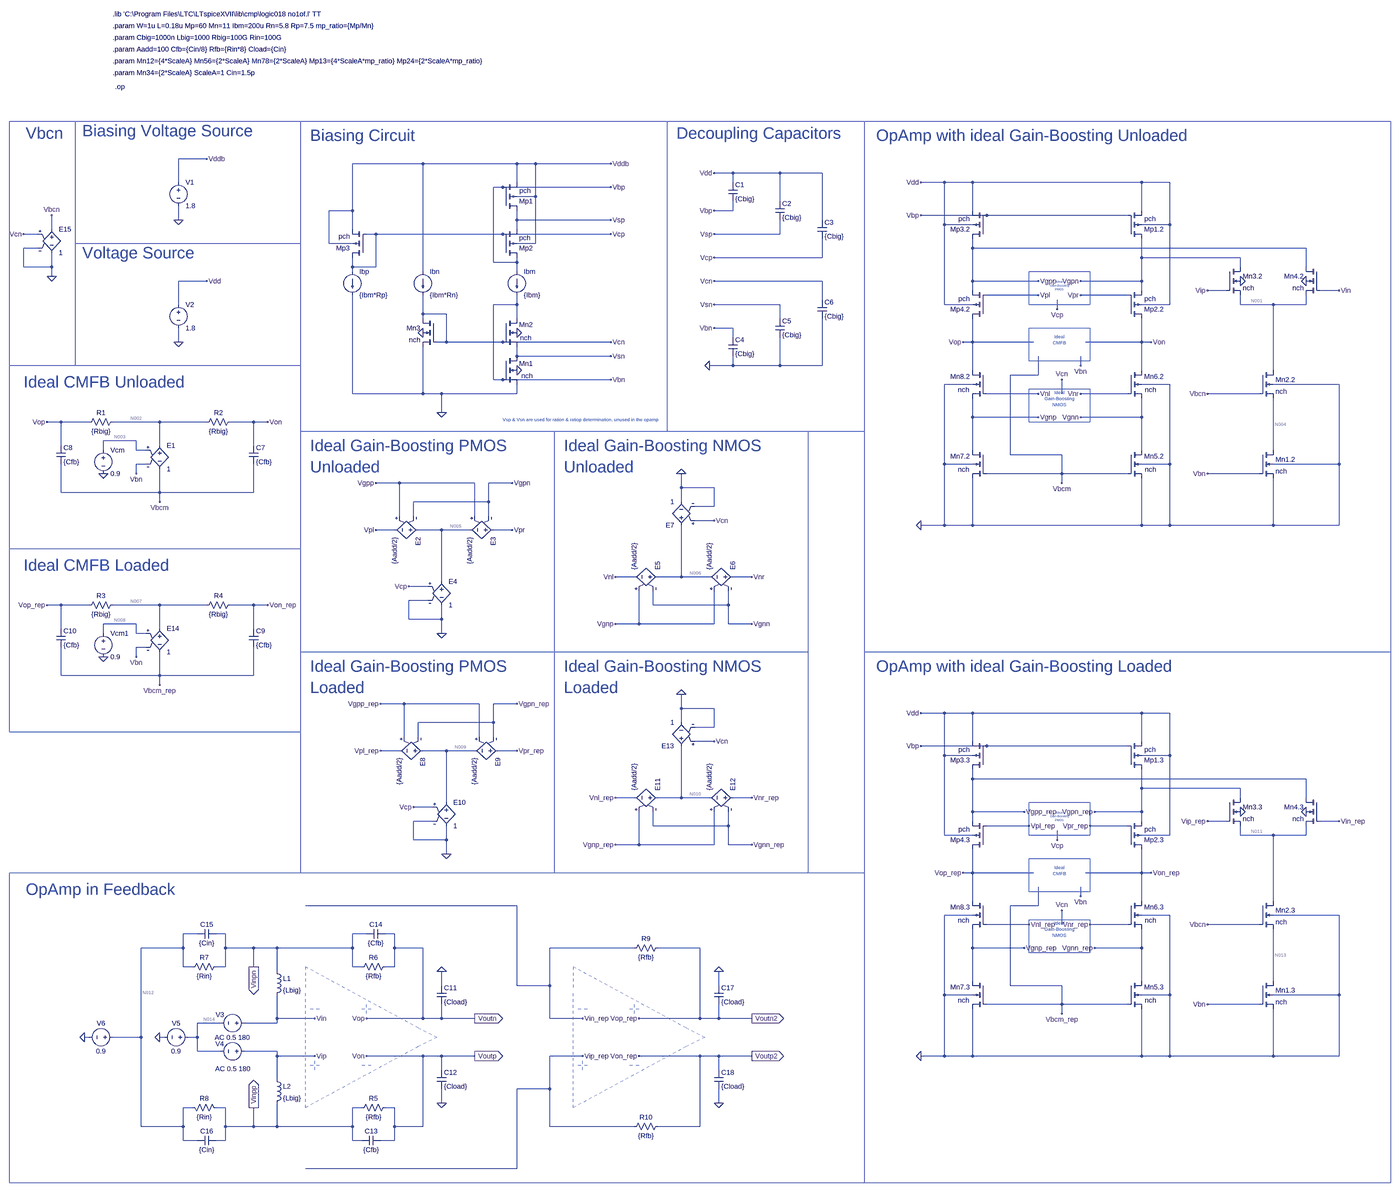
[diagram p0: schematic discrete_time_fully_differential_folded_cascode_amplifier.asc, whole sheet]
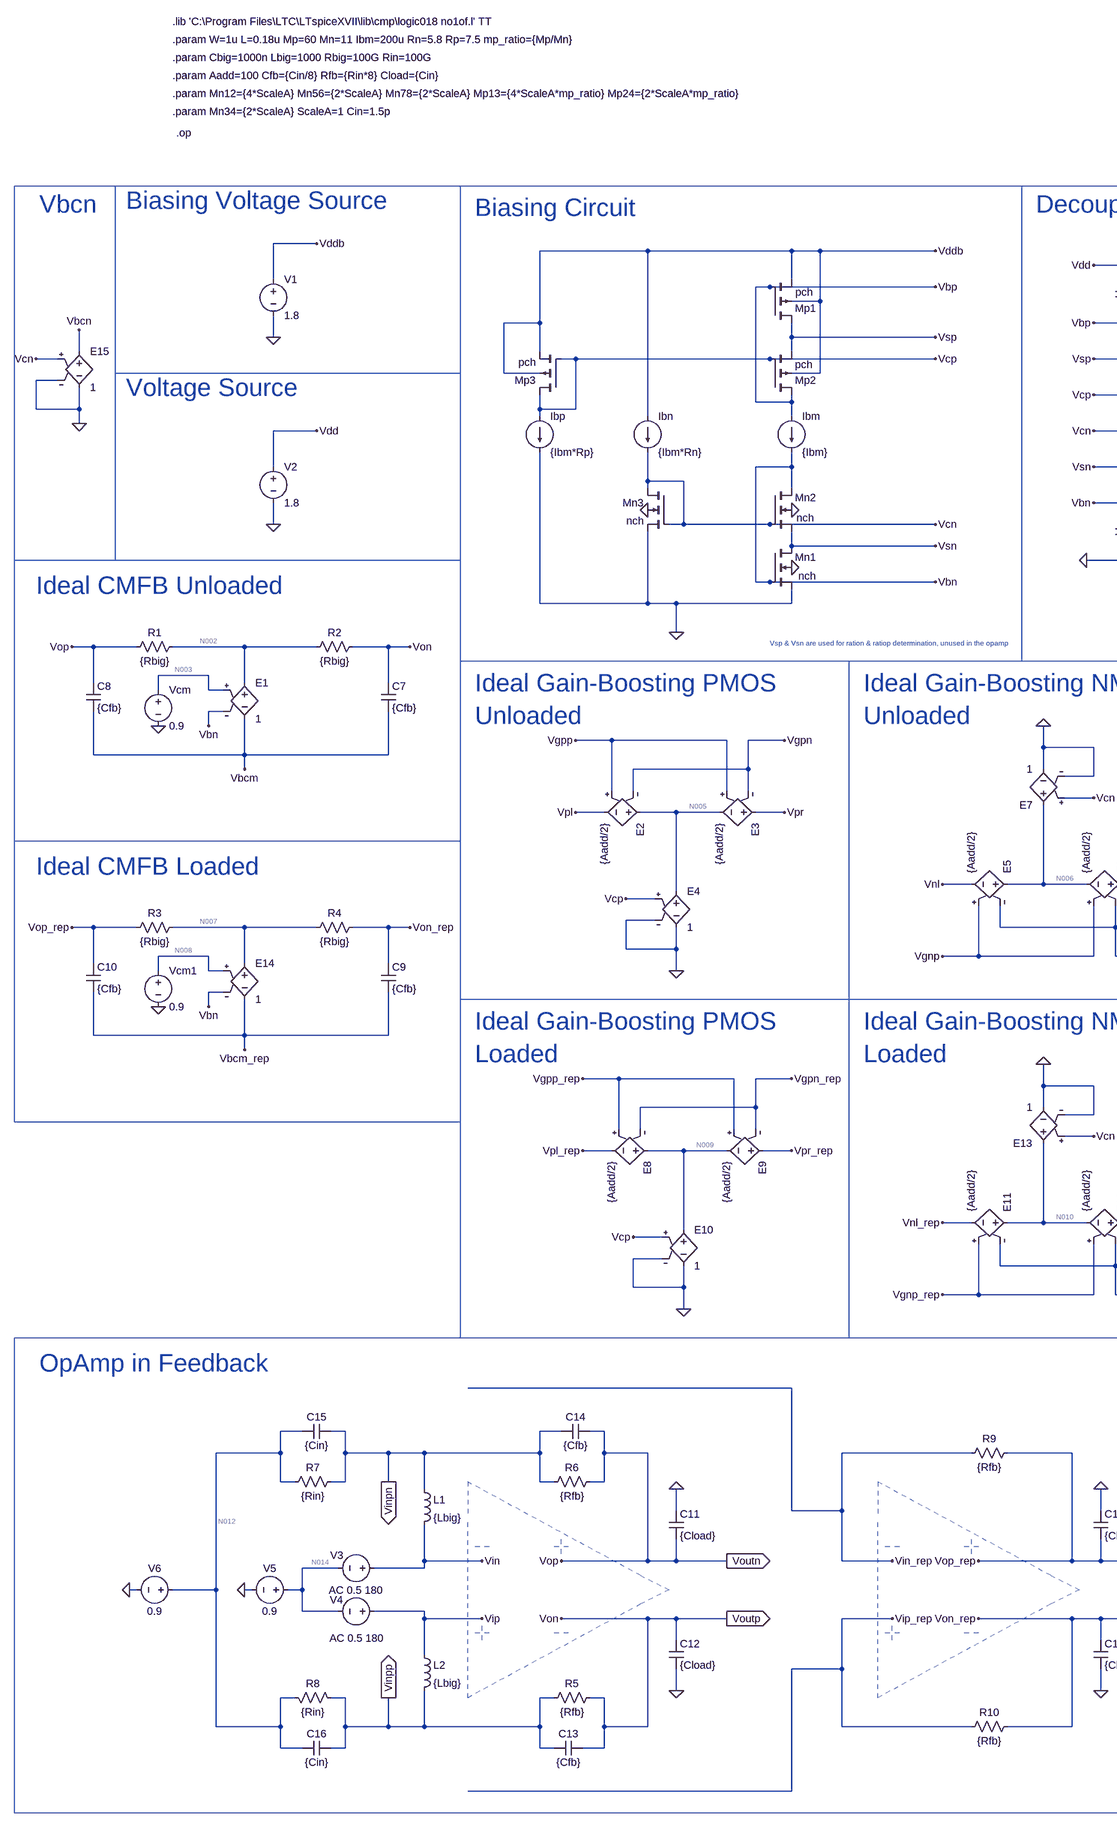
[diagram p1: schematic discrete_time_fully_differential_folded_cascode_amplifier.asc, part, row 1 of 1, column 1 of 2]
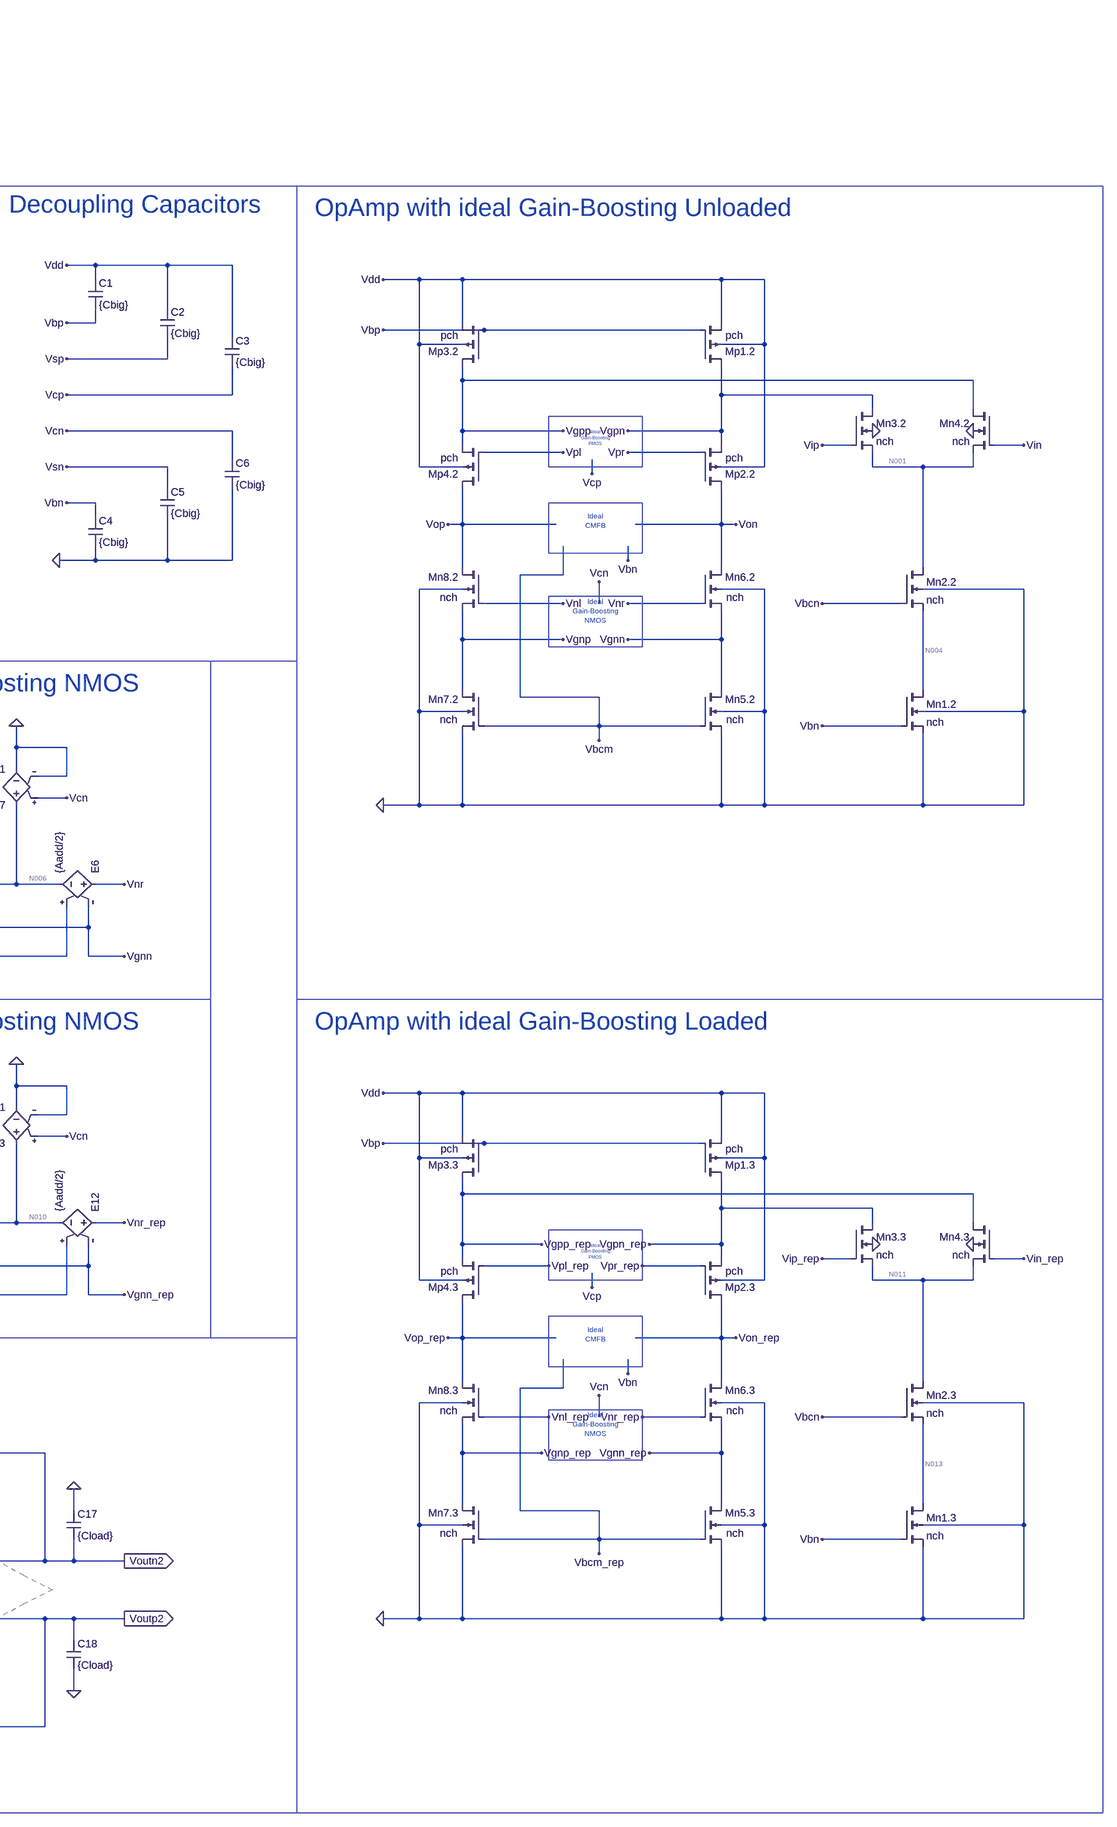
[diagram p2: schematic discrete_time_fully_differential_folded_cascode_amplifier.asc, part, row 1 of 1, column 2 of 2]
discrete_time_fully_differential_folded_cascode_amplifier.asc, the LTspice schematic file:
Version 4
SHEET 1 6308 3584
WIRE 480 -288 384 -288
WIRE 1216 -272 976 -272
WIRE 1536 -272 1216 -272
WIRE 1600 -272 1536 -272
WIRE 1856 -272 1600 -272
WIRE 2272 -240 2208 -240
WIRE 2432 -240 2272 -240
WIRE 2576 -240 2432 -240
WIRE 384 -208 384 -288
WIRE 1536 -208 1536 -272
WIRE 2272 -208 2272 -240
WIRE 2992 -208 2912 -208
WIRE 3088 -208 2992 -208
WIRE 3664 -208 3088 -208
WIRE 3760 -208 3664 -208
WIRE 1488 -192 1456 -192
WIRE 1856 -192 1488 -192
WIRE 1600 -160 1600 -272
WIRE 1600 -160 1536 -160
WIRE 2432 -144 2432 -240
WIRE 976 -112 976 -272
WIRE 976 -112 896 -112
WIRE 2272 -112 2272 -144
WIRE 2272 -112 2208 -112
WIRE 3088 -112 3088 -208
WIRE 3664 -112 3664 -208
WIRE 3136 -96 2912 -96
WIRE 3616 -96 3136 -96
WIRE 384 -80 384 -128
WIRE 1536 -80 1536 -112
WIRE 1856 -80 1536 -80
WIRE 2576 -80 2576 -240
WIRE 2992 -64 2992 -208
WIRE 3088 -64 2992 -64
WIRE 3760 -64 3760 -208
WIRE 3760 -64 3664 -64
WIRE -48 -48 -48 -96
WIRE 976 -48 976 -112
WIRE 1536 -48 1536 -80
WIRE -96 -32 -144 -32
WIRE 1056 -32 1024 -32
WIRE 1488 -32 1056 -32
WIRE 1856 -32 1488 -32
WIRE 2432 -32 2432 -80
WIRE 2432 -32 2208 -32
WIRE 896 0 896 -112
WIRE 976 0 896 0
WIRE 1600 0 1600 -160
WIRE 1600 0 1536 0
WIRE -96 16 -144 16
WIRE 3088 16 3088 -16
WIRE 4224 16 3088 16
WIRE 2576 48 2576 -16
WIRE 2576 48 2208 48
WIRE 3664 48 3664 -16
WIRE 4000 48 3664 48
WIRE 1456 64 1456 -192
WIRE 1536 64 1536 48
WIRE 1536 64 1456 64
WIRE -144 80 -144 16
WIRE -48 80 -48 32
WIRE -48 80 -144 80
WIRE 976 80 976 48
WIRE 1056 80 1056 -32
WIRE 1056 80 976 80
WIRE 4000 80 4000 48
WIRE 4224 80 4224 16
WIRE 976 96 976 80
WIRE 1216 96 1216 -272
WIRE 1536 96 1536 64
WIRE -48 112 -48 80
WIRE 480 128 384 128
WIRE 2576 128 2208 128
WIRE 3088 128 3088 16
WIRE 3312 128 3088 128
WIRE 3664 128 3664 48
WIRE 3664 128 3456 128
WIRE 3088 160 3088 128
WIRE 3664 160 3664 128
WIRE 3952 160 3888 160
WIRE 4336 160 4272 160
WIRE 3312 176 3136 176
WIRE 3616 176 3456 176
WIRE 2576 192 2576 128
WIRE 384 208 384 128
WIRE 1536 208 1536 176
WIRE 1536 208 1456 208
WIRE 2432 208 2208 208
WIRE 2992 208 2992 -64
WIRE 3088 208 2992 208
WIRE 3760 208 3760 -64
WIRE 3760 208 3664 208
WIRE 4000 208 4000 176
WIRE 4112 208 4000 208
WIRE 4224 208 4224 176
WIRE 4224 208 4112 208
WIRE 3376 224 3376 192
WIRE 1216 240 1216 176
WIRE 1296 240 1216 240
WIRE 1216 256 1216 240
WIRE 1536 256 1536 208
WIRE 2432 256 2432 208
WIRE 2272 288 2208 288
WIRE 2272 320 2272 288
WIRE 384 336 384 288
WIRE 1296 336 1296 240
WIRE 1296 336 1264 336
WIRE 1488 336 1296 336
WIRE 1856 336 1488 336
WIRE 3088 336 3088 256
WIRE 3088 336 3056 336
WIRE 3296 336 3088 336
WIRE 3664 336 3664 256
WIRE 3664 336 3472 336
WIRE 3696 336 3664 336
WIRE 1536 384 1536 352
WIRE 1856 384 1536 384
WIRE 2272 416 2272 384
WIRE 2272 416 2192 416
WIRE 2432 416 2432 320
WIRE 2432 416 2272 416
WIRE 2576 416 2576 256
WIRE 2576 416 2432 416
WIRE 3456 416 3456 384
WIRE 3088 432 3088 336
WIRE 3664 432 3664 336
WIRE 4112 432 4112 208
WIRE 3312 448 3312 384
WIRE 3312 448 3216 448
WIRE 1456 464 1456 208
WIRE 1488 464 1456 464
WIRE 1856 464 1488 464
WIRE 3088 480 2992 480
WIRE 3760 480 3664 480
WIRE 4336 480 4112 480
WIRE 976 512 976 176
WIRE 1216 512 1216 352
WIRE 1216 512 976 512
WIRE 1280 512 1216 512
WIRE 1536 512 1536 480
WIRE 1536 512 1280 512
WIRE 3312 512 3136 512
WIRE 3392 512 3392 464
WIRE 3616 512 3456 512
WIRE 4064 512 3888 512
WIRE 1280 576 1280 512
WIRE 3088 592 3088 528
WIRE 3312 592 3088 592
WIRE 3664 592 3664 528
WIRE 3664 592 3456 592
WIRE -16 608 -64 608
WIRE 80 608 -16 608
WIRE 320 608 160 608
WIRE 480 608 320 608
WIRE 640 608 560 608
WIRE 688 608 640 608
WIRE 240 672 128 672
WIRE -16 688 -16 608
WIRE 320 688 320 608
WIRE 640 688 640 608
WIRE 128 704 128 672
WIRE 240 704 240 672
WIRE 272 704 240 704
WIRE 3088 704 3088 592
WIRE 3664 704 3664 592
WIRE 4112 704 4112 528
WIRE 3216 720 3216 448
WIRE 3392 720 3216 720
WIRE 272 752 240 752
WIRE 2992 752 2992 480
WIRE 3088 752 2992 752
WIRE 3760 752 3760 480
WIRE 3760 752 3664 752
WIRE 4336 752 4336 480
WIRE 4336 752 4112 752
WIRE 240 784 240 752
WIRE 3392 784 3392 720
WIRE 3392 784 3136 784
WIRE 3616 784 3392 784
WIRE 4064 784 3888 784
WIRE 1136 816 1056 816
WIRE 1392 816 1136 816
WIRE 1520 816 1440 816
WIRE 3392 816 3392 784
WIRE 2096 832 2096 784
WIRE 2208 832 2096 832
WIRE -16 848 -16 752
WIRE 320 848 320 768
WIRE 320 848 -16 848
WIRE 640 848 640 752
WIRE 640 848 320 848
WIRE 320 880 320 848
WIRE 1440 880 1440 816
WIRE 1440 880 1184 880
WIRE 2096 880 2096 832
WIRE 2208 896 2208 832
WIRE 2208 896 2144 896
WIRE 1136 928 1136 816
WIRE 1184 928 1184 880
WIRE 1392 928 1392 816
WIRE 1440 928 1440 880
WIRE 2208 944 2144 944
WIRE 2992 960 2992 752
WIRE 2992 960 2912 960
WIRE 3088 960 3088 800
WIRE 3088 960 2992 960
WIRE 3664 960 3664 800
WIRE 3664 960 3088 960
WIRE 3760 960 3760 752
WIRE 3760 960 3664 960
WIRE 4112 960 4112 800
WIRE 4112 960 3760 960
WIRE 4336 960 4336 752
WIRE 4336 960 4112 960
WIRE 1120 976 1056 976
WIRE 1280 976 1200 976
WIRE 1376 976 1280 976
WIRE 1520 976 1456 976
WIRE 1936 1136 1872 1136
WIRE 2096 1136 2096 960
WIRE 2096 1136 2016 1136
WIRE 2192 1136 2096 1136
WIRE 2336 1136 2272 1136
WIRE 1280 1152 1280 976
WIRE 1232 1168 1168 1168
WIRE 1232 1216 1168 1216
WIRE -16 1232 -64 1232
WIRE 80 1232 -16 1232
WIRE 320 1232 160 1232
WIRE 480 1232 320 1232
WIRE 640 1232 560 1232
WIRE 688 1232 640 1232
WIRE 2000 1232 2000 1184
WIRE 2256 1232 2256 1184
WIRE 2256 1232 2000 1232
WIRE 1168 1280 1168 1216
WIRE 1280 1280 1280 1232
WIRE 1280 1280 1168 1280
WIRE 240 1296 128 1296
WIRE 1952 1296 1952 1184
WIRE 1952 1296 1872 1296
WIRE 2208 1296 2208 1184
WIRE 2208 1296 1952 1296
WIRE 2256 1296 2256 1232
WIRE 2336 1296 2256 1296
WIRE -16 1312 -16 1232
WIRE 320 1312 320 1232
WIRE 640 1312 640 1232
WIRE 128 1328 128 1296
WIRE 240 1328 240 1296
WIRE 272 1328 240 1328
WIRE 1280 1328 1280 1280
WIRE 272 1376 240 1376
WIRE 240 1408 240 1376
WIRE -16 1472 -16 1376
WIRE 320 1472 320 1392
WIRE 320 1472 -16 1472
WIRE 640 1472 640 1376
WIRE 640 1472 320 1472
WIRE 320 1504 320 1472
WIRE 1152 1568 1072 1568
WIRE 1408 1568 1152 1568
WIRE 1536 1568 1456 1568
WIRE 2096 1584 2096 1536
WIRE 2208 1584 2096 1584
WIRE 2992 1600 2912 1600
WIRE 3088 1600 2992 1600
WIRE 3664 1600 3088 1600
WIRE 3760 1600 3664 1600
WIRE 1456 1632 1456 1568
WIRE 1456 1632 1200 1632
WIRE 2096 1632 2096 1584
WIRE 2208 1648 2208 1584
WIRE 2208 1648 2144 1648
WIRE 1152 1680 1152 1568
WIRE 1200 1680 1200 1632
WIRE 1408 1680 1408 1568
WIRE 1456 1680 1456 1632
WIRE 2208 1696 2144 1696
WIRE 3088 1696 3088 1600
WIRE 3664 1696 3664 1600
WIRE 3136 1712 2912 1712
WIRE 3616 1712 3136 1712
WIRE 1136 1728 1072 1728
WIRE 1296 1728 1216 1728
WIRE 1392 1728 1296 1728
WIRE 1536 1728 1472 1728
WIRE 2992 1744 2992 1600
WIRE 3088 1744 2992 1744
WIRE 3760 1744 3760 1600
WIRE 3760 1744 3664 1744
WIRE 3088 1824 3088 1792
WIRE 4224 1824 3088 1824
WIRE 3664 1856 3664 1792
WIRE 4000 1856 3664 1856
WIRE 1936 1888 1872 1888
WIRE 2096 1888 2096 1712
WIRE 2096 1888 2016 1888
WIRE 2192 1888 2096 1888
WIRE 2336 1888 2272 1888
WIRE 4000 1888 4000 1856
WIRE 4224 1888 4224 1824
WIRE 1296 1904 1296 1728
WIRE 1248 1920 1184 1920
WIRE 3088 1936 3088 1824
WIRE 3264 1936 3088 1936
WIRE 3664 1936 3664 1856
WIRE 3664 1936 3504 1936
WIRE 1248 1968 1184 1968
WIRE 3088 1968 3088 1936
WIRE 3664 1968 3664 1936
WIRE 3952 1968 3888 1968
WIRE 4336 1968 4272 1968
WIRE 2000 1984 2000 1936
WIRE 2256 1984 2256 1936
WIRE 2256 1984 2000 1984
WIRE 3280 1984 3136 1984
WIRE 3616 1984 3488 1984
WIRE 2992 2016 2992 1744
WIRE 3088 2016 2992 2016
WIRE 3760 2016 3760 1744
WIRE 3760 2016 3664 2016
WIRE 4000 2016 4000 1984
WIRE 4112 2016 4000 2016
WIRE 4224 2016 4224 1984
WIRE 4224 2016 4112 2016
WIRE 1184 2032 1184 1968
WIRE 1296 2032 1296 1984
WIRE 1296 2032 1184 2032
WIRE 3376 2032 3376 2000
WIRE 1952 2048 1952 1936
WIRE 1952 2048 1872 2048
WIRE 2208 2048 2208 1936
WIRE 2208 2048 1952 2048
WIRE 2256 2048 2256 1984
WIRE 2336 2048 2256 2048
WIRE 1296 2080 1296 2032
WIRE 3088 2144 3088 2064
WIRE 3088 2144 3056 2144
WIRE 3296 2144 3088 2144
WIRE 3664 2144 3664 2064
WIRE 3664 2144 3472 2144
WIRE 3696 2144 3664 2144
WIRE 3456 2224 3456 2192
WIRE 3088 2240 3088 2144
WIRE 3664 2240 3664 2144
WIRE 4112 2240 4112 2016
WIRE 1536 2256 816 2256
WIRE 3312 2256 3312 2192
WIRE 3312 2256 3216 2256
WIRE 3088 2288 2992 2288
WIRE 3760 2288 3664 2288
WIRE 4336 2288 4112 2288
WIRE 3280 2320 3136 2320
WIRE 3392 2320 3392 2272
WIRE 3616 2320 3488 2320
WIRE 4064 2320 3888 2320
WIRE 448 2352 400 2352
WIRE 544 2352 512 2352
WIRE 1024 2352 976 2352
WIRE 1120 2352 1088 2352
WIRE 400 2400 400 2352
WIRE 400 2400 256 2400
WIRE 544 2400 544 2352
WIRE 640 2400 544 2400
WIRE 720 2400 640 2400
WIRE 976 2400 976 2352
WIRE 976 2400 720 2400
WIRE 1120 2400 1120 2352
WIRE 1216 2400 1120 2400
WIRE 1936 2400 1648 2400
WIRE 2160 2400 2016 2400
WIRE 3088 2400 3088 2336
WIRE 3264 2400 3088 2400
WIRE 3664 2400 3664 2336
WIRE 3664 2400 3504 2400
WIRE 400 2464 400 2400
WIRE 432 2464 400 2464
WIRE 544 2464 544 2400
WIRE 544 2464 512 2464
WIRE 640 2464 640 2400
WIRE 976 2464 976 2400
WIRE 1008 2464 976 2464
WIRE 1120 2464 1120 2400
WIRE 1120 2464 1088 2464
WIRE 720 2480 720 2400
WIRE 3088 2512 3088 2400
WIRE 3664 2512 3664 2400
WIRE 4112 2512 4112 2336
WIRE 1280 2528 1280 2480
WIRE 1536 2528 1536 2256
WIRE 1648 2528 1648 2400
WIRE 1648 2528 1536 2528
WIRE 2224 2528 2224 2480
WIRE 3216 2528 3216 2256
WIRE 3392 2528 3216 2528
WIRE 2992 2560 2992 2288
WIRE 3088 2560 2992 2560
WIRE 3760 2560 3760 2288
WIRE 3760 2560 3664 2560
WIRE 4336 2560 4336 2288
WIRE 4336 2560 4112 2560
WIRE 3392 2592 3392 2528
WIRE 3392 2592 3136 2592
WIRE 3616 2592 3392 2592
WIRE 4064 2592 3888 2592
WIRE 3392 2624 3392 2592
WIRE 720 2640 720 2560
WIRE 848 2640 720 2640
WIRE 1216 2640 1216 2400
WIRE 1216 2640 1024 2640
WIRE 1280 2640 1280 2592
WIRE 1280 2640 1216 2640
WIRE 1392 2640 1280 2640
WIRE 1648 2640 1648 2528
WIRE 1760 2640 1648 2640
WIRE 2160 2640 2160 2400
WIRE 2160 2640 1952 2640
WIRE 2224 2640 2224 2592
WIRE 2224 2640 2160 2640
WIRE 2336 2640 2224 2640
WIRE 528 2656 448 2656
WIRE 720 2656 720 2640
WIRE 720 2656 608 2656
WIRE 80 2704 64 2704
WIRE 256 2704 256 2400
WIRE 256 2704 160 2704
WIRE 336 2704 320 2704
WIRE 448 2704 448 2656
WIRE 448 2704 416 2704
WIRE 448 2752 448 2704
WIRE 528 2752 448 2752
WIRE 720 2752 608 2752
WIRE 720 2768 720 2752
WIRE 848 2768 720 2768
WIRE 1216 2768 1024 2768
WIRE 1280 2768 1216 2768
WIRE 1392 2768 1280 2768
WIRE 1760 2768 1648 2768
WIRE 2160 2768 1952 2768
WIRE 2224 2768 2160 2768
WIRE 2336 2768 2224 2768
WIRE 2992 2768 2992 2560
WIRE 2992 2768 2912 2768
WIRE 3088 2768 3088 2608
WIRE 3088 2768 2992 2768
WIRE 3664 2768 3664 2608
WIRE 3664 2768 3088 2768
WIRE 3760 2768 3760 2560
WIRE 3760 2768 3664 2768
WIRE 4112 2768 4112 2608
WIRE 4112 2768 3760 2768
WIRE 4336 2768 4336 2560
WIRE 4336 2768 4112 2768
WIRE 1280 2816 1280 2768
WIRE 2224 2816 2224 2768
WIRE 720 2848 720 2768
WIRE 1648 2880 1648 2768
WIRE 1648 2880 1536 2880
WIRE 1280 2928 1280 2880
WIRE 2224 2928 2224 2880
WIRE 432 2944 400 2944
WIRE 544 2944 512 2944
WIRE 1008 2944 976 2944
WIRE 1120 2944 1088 2944
WIRE 256 3008 256 2704
WIRE 400 3008 400 2944
WIRE 400 3008 256 3008
WIRE 544 3008 544 2944
WIRE 640 3008 640 2944
WIRE 640 3008 544 3008
WIRE 720 3008 720 2928
WIRE 720 3008 640 3008
WIRE 976 3008 976 2944
WIRE 976 3008 720 3008
WIRE 1120 3008 1120 2944
WIRE 1216 3008 1216 2768
WIRE 1216 3008 1120 3008
WIRE 1648 3008 1648 2880
WIRE 1936 3008 1648 3008
WIRE 2160 3008 2160 2768
WIRE 2160 3008 2016 3008
WIRE 400 3056 400 3008
WIRE 448 3056 400 3056
WIRE 544 3056 544 3008
WIRE 544 3056 512 3056
WIRE 976 3056 976 3008
WIRE 1008 3056 976 3056
WIRE 1120 3056 1120 3008
WIRE 1120 3056 1072 3056
WIRE 1536 3152 1536 2880
WIRE 1536 3152 816 3152
FLAG 1280 576 0
FLAG 1856 -192 Vbp
FLAG 1856 -80 Vsp
FLAG 1856 -32 Vcp
FLAG 1856 336 Vcn
FLAG 1856 384 Vsn
FLAG 1856 464 Vbn
FLAG 1856 -272 Vddb
FLAG 1216 304 0
FLAG 1536 304 0
FLAG 1536 432 0
FLAG 384 -80 0
FLAG 480 -288 Vddb
FLAG 384 336 0
FLAG 480 128 Vdd
FLAG 2208 -240 Vdd
FLAG 2208 -112 Vbp
FLAG 2208 -32 Vsp
FLAG 2208 48 Vcp
FLAG 2208 288 Vbn
FLAG 2208 208 Vsn
FLAG 2208 128 Vcn
FLAG 2192 416 0
FLAG 128 784 0
FLAG 320 880 Vbcm
FLAG -64 608 Vop
FLAG 688 608 Von
FLAG 240 784 Vbn
FLAG 1280 1328 0
FLAG 1520 816 Vgpn
FLAG 1056 816 Vgpp
FLAG 1056 976 Vpl
FLAG 1520 976 Vpr
FLAG 1168 1168 Vcp
FLAG 2096 784 0
FLAG 2336 1296 Vgnn
FLAG 1872 1296 Vgnp
FLAG 1872 1136 Vnl
FLAG 2336 1136 Vnr
FLAG 2208 944 Vcn
FLAG 3312 128 Vgpp
FLAG 3312 176 Vpl
FLAG 3456 128 Vgpn
FLAG 3456 176 Vpr
FLAG 3376 224 Vcp
FLAG 2912 -208 Vdd
FLAG 2912 -96 Vbp
FLAG 3456 416 Vbn
FLAG 3056 336 Vop
FLAG 3696 336 Von
FLAG 3312 512 Vnl
FLAG 3456 512 Vnr
FLAG 3456 592 Vgnn
FLAG 3312 592 Vgnp
FLAG 3392 464 Vcn
FLAG 3392 816 Vbcm
FLAG 2912 960 0
FLAG 4224 128 0
FLAG 4000 128 0
FLAG 3888 160 Vip
FLAG 4336 160 Vin
FLAG 3888 512 Vbcn
FLAG 3888 784 Vbn
FLAG 1024 2640 Vop
FLAG 1024 2768 Von
FLAG 3264 1936 Vgpp_rep
FLAG 3280 1984 Vpl_rep
FLAG 3504 1936 Vgpn_rep
FLAG 3488 1984 Vpr_rep
FLAG 3376 2032 Vcp
FLAG 2912 1600 Vdd
FLAG 2912 1712 Vbp
FLAG 3456 2224 Vbn
FLAG 3056 2144 Vop_rep
FLAG 3696 2144 Von_rep
FLAG 3280 2320 Vnl_rep
FLAG 3488 2320 Vnr_rep
FLAG 3504 2400 Vgnn_rep
FLAG 3264 2400 Vgnp_rep
FLAG 3392 2272 Vcn
FLAG 3392 2624 Vbcm_rep
FLAG 2912 2768 0
FLAG 4224 1936 0
FLAG 4000 1936 0
FLAG 3888 1968 Vip_rep
FLAG 4336 1968 Vin_rep
FLAG 3888 2320 Vbcn
FLAG 3888 2592 Vbn
FLAG 1296 2080 0
FLAG 1536 1568 Vgpn_rep
FLAG 1072 1568 Vgpp_rep
FLAG 1072 1728 Vpl_rep
FLAG 1536 1728 Vpr_rep
FLAG 1184 1920 Vcp
FLAG 2096 1536 0
FLAG 2336 2048 Vgnn_rep
FLAG 1872 2048 Vgnp_rep
FLAG 1872 1888 Vnl_rep
FLAG 2336 1888 Vnr_rep
FLAG 2208 1696 Vcn
FLAG 128 1408 0
FLAG 320 1504 Vbcm_rep
FLAG -64 1232 Vop_rep
FLAG 688 1232 Von_rep
FLAG 240 1408 Vbn
FLAG -144 -32 Vcn
FLAG -48 112 0
FLAG -48 -96 Vbcn
FLAG 1280 2480 0
FLAG 1392 2640 Voutn
IOPIN 1392 2640 Out
FLAG 1392 2768 Voutp
IOPIN 1392 2768 Out
FLAG 1280 2928 0
FLAG 848 2640 Vin
FLAG 848 2768 Vip
FLAG 640 2464 Vinpn
IOPIN 640 2464 Out
FLAG 640 2944 Vinpp
IOPIN 640 2944 Out
FLAG 320 2704 0
FLAG 64 2704 0
FLAG 1952 2640 Vop_rep
FLAG 1952 2768 Von_rep
FLAG 1760 2640 Vin_rep
FLAG 1760 2768 Vip_rep
FLAG 2224 2480 0
FLAG 2336 2640 Voutn2
IOPIN 2336 2640 Out
FLAG 2336 2768 Voutp2
IOPIN 2336 2768 Out
FLAG 2224 2928 0
DATAFLAG 1712 -192 ""
DATAFLAG 1712 -80 ""
DATAFLAG 1712 -32 ""
DATAFLAG 1728 336 ""
DATAFLAG 1728 384 ""
DATAFLAG 1728 464 ""
SYMBOL pmos4 1488 -112 M180
WINDOW 3 57 68 Left 2
SYMATTR InstName Mp1
SYMATTR Value pch
SYMATTR Value2 l={L} w={W} m={Mp}
SYMBOL pmos4 1488 48 M180
WINDOW 3 56 67 Left 2
SYMATTR InstName Mp2
SYMATTR Value pch
SYMATTR Value2 l={L} w={W} m={Mp}
SYMBOL pmos4 1024 48 R180
SYMATTR InstName Mp3
SYMATTR Value pch
SYMATTR Value2 l={L} w={W} m={Mp}
SYMBOL nmos4 1488 384 R0
WINDOW 0 56 25 Left 2
WINDOW 3 63 67 Left 2
SYMATTR InstName Mn1
SYMATTR Value nch
SYMATTR Value2 l={L} w={W} m={Mn}
SYMBOL nmos4 1488 256 R0
WINDOW 0 56 21 Left 2
WINDOW 3 59 66 Left 2
SYMATTR InstName Mn2
SYMATTR Value nch
SYMATTR Value2 l={L} w={W} m={Mn}
SYMBOL nmos4 1264 256 M0
SYMATTR InstName Mn3
SYMATTR Value nch
SYMATTR Value2 l={L} w={W} m={Mn}
SYMBOL current 1536 96 R0
SYMATTR InstName Ibm
SYMATTR Value {Ibm}
SYMBOL current 1216 96 R0
WINDOW 123 0 0 Left 0
WINDOW 39 0 0 Left 0
SYMATTR InstName Ibn
SYMATTR Value {Ibm*Rn}
SYMBOL current 976 96 R0
WINDOW 123 0 0 Left 0
WINDOW 39 0 0 Left 0
SYMATTR InstName Ibp
SYMATTR Value {Ibm*Rp}
SYMBOL voltage 384 -224 R0
WINDOW 123 0 0 Left 0
WINDOW 39 0 0 Left 0
SYMATTR InstName V1
SYMATTR Value 1.8
SYMBOL voltage 384 192 R0
WINDOW 123 0 0 Left 0
WINDOW 39 0 0 Left 0
SYMATTR InstName V2
SYMATTR Value 1.8
SYMBOL cap 2256 -208 R0
SYMATTR InstName C1
SYMATTR Value {Cbig}
SYMBOL cap 2416 -144 R0
SYMATTR InstName C2
SYMATTR Value {Cbig}
SYMBOL cap 2560 -80 R0
SYMATTR InstName C3
SYMATTR Value {Cbig}
SYMBOL cap 2256 384 M180
WINDOW 0 24 56 Left 2
WINDOW 3 24 8 Left 2
SYMATTR InstName C4
SYMATTR Value {Cbig}
SYMBOL cap 2416 320 M180
WINDOW 0 24 56 Left 2
WINDOW 3 24 8 Left 2
SYMATTR InstName C5
SYMATTR Value {Cbig}
SYMBOL cap 2560 256 M180
WINDOW 0 24 56 Left 2
WINDOW 3 24 8 Left 2
SYMATTR InstName C6
SYMATTR Value {Cbig}
SYMBOL e 320 672 R0
SYMATTR InstName E1
SYMATTR Value 1
SYMBOL res 176 592 R90
WINDOW 0 0 56 VBottom 2
WINDOW 3 32 56 VTop 2
SYMATTR InstName R1
SYMATTR Value {Rbig}
SYMBOL res 576 592 R90
WINDOW 0 0 56 VBottom 2
WINDOW 3 32 56 VTop 2
SYMATTR InstName R2
SYMATTR Value {Rbig}
SYMBOL cap 624 688 R0
SYMATTR InstName C7
SYMATTR Value {Cfb}
SYMBOL cap -32 688 R0
SYMATTR InstName C8
SYMATTR Value {Cfb}
SYMBOL voltage 128 688 R0
WINDOW 123 0 0 Left 0
WINDOW 39 0 0 Left 0
SYMATTR InstName Vcm
SYMATTR Value 0.9
SYMBOL e2 1216 976 R90
SYMATTR InstName E2
SYMATTR Value {Aadd/2}
SYMBOL e2 1472 976 R90
SYMATTR InstName E3
SYMATTR Value {Aadd/2}
SYMBOL e 1280 1136 R0
SYMATTR InstName E4
SYMATTR Value 1
SYMBOL e2 2032 1136 M270
SYMATTR InstName E5
SYMATTR Value {Aadd/2}
SYMBOL e2 2288 1136 M270
SYMATTR InstName E6
SYMATTR Value {Aadd/2}
SYMBOL e 2096 976 R180
SYMATTR InstName E7
SYMATTR Value 1
SYMBOL pmos4 3616 -16 M180
WINDOW 3 57 68 Left 2
SYMATTR InstName Mp1.2
SYMATTR Value pch
SYMATTR Value2 l={L} w={W} m={Mp13}
SYMBOL nmos4 3616 704 R0
WINDOW 0 56 21 Left 2
WINDOW 3 59 66 Left 2
SYMATTR InstName Mn5.2
SYMATTR Value nch
SYMATTR Value2 l={L} w={W} m={Mn56}
SYMBOL pmos4 3616 256 M180
WINDOW 3 57 68 Left 2
SYMATTR InstName Mp2.2
SYMATTR Value pch
SYMATTR Value2 l={L} w={W} m={Mp24}
SYMBOL nmos4 3616 432 R0
WINDOW 0 56 21 Left 2
WINDOW 3 59 66 Left 2
SYMATTR InstName Mn6.2
SYMATTR Value nch
SYMATTR Value2 l={L} w={W} m={Mn56}
SYMBOL pmos4 3136 -16 R180
WINDOW 3 57 68 Left 2
SYMATTR InstName Mp3.2
SYMATTR Value pch
SYMATTR Value2 l={L} w={W} m={Mp13}
SYMBOL nmos4 3136 704 M0
WINDOW 0 56 21 Left 2
WINDOW 3 59 66 Left 2
SYMATTR InstName Mn7.2
SYMATTR Value nch
SYMATTR Value2 l={L} w={W} m={Mn78}
SYMBOL pmos4 3136 256 R180
WINDOW 3 57 68 Left 2
SYMATTR InstName Mp4.2
SYMATTR Value pch
SYMATTR Value2 l={L} w={W} m={Mp24}
SYMBOL nmos4 3136 432 M0
WINDOW 0 56 21 Left 2
WINDOW 3 59 66 Left 2
SYMATTR InstName Mn8.2
SYMATTR Value nch
SYMATTR Value2 l={L} w={W} m={Mn78}
SYMBOL nmos4 4272 80 M0
SYMATTR InstName Mn4.2
SYMATTR Value nch
SYMATTR Value2 l={L} w={W} m={Mn34}
SYMBOL nmos4 3952 80 R0
SYMATTR InstName Mn3.2
SYMATTR Value nch
SYMATTR Value2 l={L} w={W} m={Mn34}
SYMBOL nmos4 4064 432 R0
SYMATTR InstName Mn2.2
SYMATTR Value nch
SYMATTR Value2 l={L} w={W} m={Mn12}
SYMBOL nmos4 4064 704 R0
SYMATTR InstName Mn1.2
SYMATTR Value nch
SYMATTR Value2 l={L} w={W} m={Mn12}
SYMBOL pmos4 3616 1792 M180
WINDOW 3 57 68 Left 2
SYMATTR InstName Mp1.3
SYMATTR Value pch
SYMATTR Value2 l={L} w={W} m={Mp13}
SYMBOL nmos4 3616 2512 R0
WINDOW 0 56 21 Left 2
WINDOW 3 59 66 Left 2
SYMATTR InstName Mn5.3
SYMATTR Value nch
SYMATTR Value2 l={L} w={W} m={Mn56}
SYMBOL pmos4 3616 2064 M180
WINDOW 3 57 68 Left 2
SYMATTR InstName Mp2.3
SYMATTR Value pch
SYMATTR Value2 l={L} w={W} m={Mp24}
SYMBOL nmos4 3616 2240 R0
WINDOW 0 56 21 Left 2
WINDOW 3 59 66 Left 2
SYMATTR InstName Mn6.3
SYMATTR Value nch
SYMATTR Value2 l={L} w={W} m={Mn56}
SYMBOL pmos4 3136 1792 R180
WINDOW 3 57 68 Left 2
SYMATTR InstName Mp3.3
SYMATTR Value pch
SYMATTR Value2 l={L} w={W} m={Mp13}
SYMBOL nmos4 3136 2512 M0
WINDOW 0 56 21 Left 2
WINDOW 3 59 66 Left 2
SYMATTR InstName Mn7.3
SYMATTR Value nch
SYMATTR Value2 l={L} w={W} m={Mn78}
SYMBOL pmos4 3136 2064 R180
WINDOW 3 57 68 Left 2
SYMATTR InstName Mp4.3
SYMATTR Value pch
SYMATTR Value2 l={L} w={W} m={Mp24}
SYMBOL nmos4 3136 2240 M0
WINDOW 0 56 21 Left 2
WINDOW 3 59 66 Left 2
SYMATTR InstName Mn8.3
SYMATTR Value nch
SYMATTR Value2 l={L} w={W} m={Mn78}
SYMBOL nmos4 4272 1888 M0
SYMATTR InstName Mn4.3
SYMATTR Value nch
SYMATTR Value2 l={L} w={W} m={Mn34}
SYMBOL nmos4 3952 1888 R0
SYMATTR InstName Mn3.3
SYMATTR Value nch
SYMATTR Value2 l={L} w={W} m={Mn34}
SYMBOL nmos4 4064 2240 R0
SYMATTR InstName Mn2.3
SYMATTR Value nch
SYMATTR Value2 l={L} w={W} m={Mn12}
SYMBOL nmos4 4064 2512 R0
SYMATTR InstName Mn1.3
SYMATTR Value nch
SYMATTR Value2 l={L} w={W} m={Mn12}
SYMBOL e2 1232 1728 R90
SYMATTR InstName E8
SYMATTR Value {Aadd/2}
SYMBOL e2 1488 1728 R90
SYMATTR InstName E9
SYMATTR Value {Aadd/2}
SYMBOL e 1296 1888 R0
SYMATTR InstName E10
SYMATTR Value 1
SYMBOL e2 2032 1888 M270
SYMATTR InstName E11
SYMATTR Value {Aadd/2}
SYMBOL e2 2288 1888 M270
SYMATTR InstName E12
SYMATTR Value {Aadd/2}
SYMBOL e 2096 1728 R180
SYMATTR InstName E13
SYMATTR Value 1
SYMBOL e 320 1296 R0
SYMATTR InstName E14
SYMATTR Value 1
SYMBOL res 176 1216 R90
WINDOW 0 0 56 VBottom 2
WINDOW 3 32 56 VTop 2
SYMATTR InstName R3
SYMATTR Value {Rbig}
SYMBOL res 576 1216 R90
WINDOW 0 0 56 VBottom 2
WINDOW 3 32 56 VTop 2
SYMATTR InstName R4
SYMATTR Value {Rbig}
SYMBOL cap 624 1312 R0
SYMATTR InstName C9
SYMATTR Value {Cfb}
SYMBOL cap -32 1312 R0
SYMATTR InstName C10
SYMATTR Value {Cfb}
SYMBOL voltage 128 1312 R0
WINDOW 123 0 0 Left 0
WINDOW 39 0 0 Left 0
SYMATTR InstName Vcm1
SYMATTR Value 0.9
SYMBOL e -48 -64 R0
SYMATTR InstName E15
SYMATTR Value 1
SYMBOL cap 1264 2528 R0
SYMATTR InstName C11
SYMATTR Value {Cload}
SYMBOL cap 1264 2880 M180
WINDOW 0 24 56 Left 2
WINDOW 3 24 8 Left 2
SYMATTR InstName C12
SYMATTR Value {Cload}
SYMBOL ind 704 2464 R0
SYMATTR InstName L1
SYMATTR Value {Lbig}
SYMBOL ind 704 2832 R0
SYMATTR InstName L2
SYMATTR Value {Lbig}
SYMBOL res 1104 2928 R90
WINDOW 0 0 56 VBottom 2
WINDOW 3 32 56 VTop 2
SYMATTR InstName R5
SYMATTR Value {Rfb}
SYMBOL cap 1072 3040 R90
WINDOW 0 0 32 VBottom 2
WINDOW 3 32 32 VTop 2
SYMATTR InstName C13
SYMATTR Value {Cfb}
SYMBOL res 992 2480 R270
WINDOW 0 32 56 VTop 2
WINDOW 3 0 56 VBottom 2
SYMATTR InstName R6
SYMATTR Value {Rfb}
SYMBOL cap 1024 2368 R270
WINDOW 0 32 32 VTop 2
WINDOW 3 0 32 VBottom 2
SYMATTR InstName C14
SYMATTR Value {Cfb}
SYMBOL res 416 2480 R270
WINDOW 0 32 56 VTop 2
WINDOW 3 0 56 VBottom 2
SYMATTR InstName R7
SYMATTR Value {Rin}
SYMBOL cap 448 2368 R270
WINDOW 0 32 32 VTop 2
WINDOW 3 0 32 VBottom 2
SYMATTR InstName C15
SYMATTR Value {Cin}
SYMBOL res 416 2928 M90
WINDOW 0 0 56 VBottom 2
WINDOW 3 32 56 VTop 2
SYMATTR InstName R8
SYMATTR Value {Rin}
SYMBOL cap 448 3040 M90
WINDOW 0 0 32 VBottom 2
WINDOW 3 32 32 VTop 2
SYMATTR InstName C16
SYMATTR Value {Cin}
SYMBOL voltage 624 2656 R90
WINDOW 0 -13 99 VBottom 2
WINDOW 3 32 56 VTop 2
WINDOW 123 33 56 VTop 2
WINDOW 39 0 0 Left 0
SYMATTR InstName V3
SYMATTR Value ""
SYMATTR Value2 AC 0.5 180
SYMBOL voltage 624 2752 R90
WINDOW 0 -10 100 VBottom 2
WINDOW 3 32 56 VTop 2
WINDOW 123 44 55 VTop 2
WINDOW 39 0 0 Left 0
SYMATTR InstName V4
SYMATTR Value ""
SYMATTR Value2 AC 0.5 180
SYMBOL voltage 432 2704 R90
WINDOW 0 -32 56 VBottom 2
WINDOW 3 32 56 VTop 2
WINDOW 123 0 0 Left 0
WINDOW 39 0 0 Left 0
SYMATTR InstName V5
SYMATTR Value 0.9
SYMBOL voltage 176 2704 R90
WINDOW 0 -32 56 VBottom 2
WINDOW 3 32 56 VTop 2
WINDOW 123 0 0 Left 0
WINDOW 39 0 0 Left 0
SYMATTR InstName V6
SYMATTR Value 0.9
SYMBOL cap 2208 2528 R0
SYMATTR InstName C17
SYMATTR Value {Cload}
SYMBOL cap 2208 2880 M180
WINDOW 0 24 56 Left 2
WINDOW 3 24 8 Left 2
SYMATTR InstName C18
SYMATTR Value {Cload}
SYMBOL res 1920 2416 R270
WINDOW 0 32 56 VTop 2
WINDOW 3 0 56 VBottom 2
SYMATTR InstName R9
SYMATTR Value {Rfb}
SYMBOL res 1920 3024 R270
WINDOW 0 32 56 VTop 2
WINDOW 3 0 56 VBottom 2
SYMATTR InstName R10
SYMATTR Value {Rfb}
TEXT 160 -992 Left 2 !.param W=1u L=0.18u Mp=60 Mn=11 Ibm=200u Rn=5.8 Rp=7.5 mp_ratio={Mp/Mn}
TEXT 160 -1032 Left 2 !.lib 'C:\\Program Files\\LTC\\LTspiceXVII\\lib\\cmp\\logic018 no1of.l' TT
TEXT 832 -368 Left 5 ;Biasing Circuit
TEXT 56 -384 Left 5 ;Biasing Voltage Source
TEXT 56 32 Left 5 ;Voltage Source
TEXT 160 -952 Left 2 !.param Cbig=1000n Lbig=1000 Rbig=100G Rin=100G
TEXT 2080 -376 Left 5 ;Decoupling Capacitors
TEXT -144 472 Left 5 ;Ideal CMFB Unloaded
TEXT 832 688 Left 5 ;Ideal Gain-Boosting PMOS\nUnloaded
TEXT 1696 688 Left 5 ;Ideal Gain-Boosting NMOS\nUnloaded
TEXT 3384 144 Center 0 ;Ideal\nGain-Boosting\nPMOS
TEXT 3384 328 Center 1 ;Ideal\nCMFB
TEXT 3384 528 Center 1 ;Ideal\nGain-Boosting\nNMOS
TEXT 2760 -368 Left 5 ;OpAmp with ideal Gain-Boosting Unloaded
TEXT 3384 1952 Center 0 ;Ideal\nGain-Boosting\nPMOS
TEXT 3384 2136 Center 1 ;Ideal\nCMFB
TEXT 3384 2336 Center 1 ;Ideal\nGain-Boosting\nNMOS
TEXT 2760 1440 Left 5 ;OpAmp with ideal Gain-Boosting Loaded
TEXT 832 1440 Left 5 ;Ideal Gain-Boosting PMOS\nLoaded
TEXT 1696 1440 Left 5 ;Ideal Gain-Boosting NMOS\nLoaded
TEXT -144 1096 Left 5 ;Ideal CMFB Loaded
TEXT 1488 600 Left 1 ;Vsp & Vsn are used for ration & ratiop determination, unused in the opamp
TEXT -136 -376 Left 5 ;Vbcn
TEXT -136 2200 Left 5 ;OpAmp in Feedback
TEXT 160 -912 Left 2 !.param Aadd=100 Cfb={Cin/8} Rfb={Rin*8} Cload={Cin}
TEXT 160 -872 Left 2 !.param Mn12={4*ScaleA} Mn56={2*ScaleA} Mn78={2*ScaleA} Mp13={4*ScaleA*mp_ratio} Mp24={2*ScaleA*mp_ratio}
TEXT 160 -832 Left 2 !.param Mn34={2*ScaleA} ScaleA=1 Cin=1.5p
TEXT 168 -784 Left 2 !.op
LINE Normal 816 2864 816 2544 2
LINE Normal 864 2608 832 2608 2
LINE Normal 848 2816 848 2784 2
LINE Normal 864 2800 832 2800 2
LINE Normal 1024 2624 1024 2592 2
LINE Normal 1040 2608 1008 2608 2
LINE Normal 1040 2800 1008 2800 2
LINE Normal 816 2464 816 2544 2
LINE Normal 1200 2672 816 2464 2
LINE Normal 816 2944 816 2864 2
LINE Normal 1200 2736 816 2944 2
LINE Normal 1264 2704 1200 2736 2
LINE Normal 1200 2672 1264 2704 2
LINE Normal 1728 2864 1728 2544 2
LINE Normal 1776 2608 1744 2608 2
LINE Normal 1760 2816 1760 2784 2
LINE Normal 1776 2800 1744 2800 2
LINE Normal 1936 2624 1936 2592 2
LINE Normal 1952 2608 1920 2608 2
LINE Normal 1952 2800 1920 2800 2
LINE Normal 1728 2464 1728 2544 2
LINE Normal 2112 2672 1728 2464 2
LINE Normal 1728 2944 1728 2864 2
LINE Normal 2112 2736 1728 2944 2
LINE Normal 2176 2704 2112 2736 2
LINE Normal 2112 2672 2176 2704 2
RECTANGLE Normal 2048 640 800 -416
RECTANGLE Normal 32 0 800 -416
RECTANGLE Normal 32 416 800 0
RECTANGLE Normal 2720 640 2048 -416
RECTANGLE Normal -192 1040 800 416
RECTANGLE Normal 1664 1392 800 640
RECTANGLE Normal 2528 1392 1664 640
RECTANGLE Normal 3488 208 3280 96
RECTANGLE Normal 3488 400 3280 288
RECTANGLE Normal 3488 608 3280 496
RECTANGLE Normal 4512 1392 2720 -416
RECTANGLE Normal 3488 2016 3280 1904
RECTANGLE Normal 3488 2208 3280 2096
RECTANGLE Normal 3488 2416 3280 2304
RECTANGLE Normal 4512 3200 2720 1392
RECTANGLE Normal 1664 2144 800 1392
RECTANGLE Normal 2528 2144 1664 1392
RECTANGLE Normal -192 1664 800 1040
RECTANGLE Normal -192 416 32 -416
RECTANGLE Normal -192 2144 2720 3200

The netlist it stands for:
* discrete_time_fully_differential_folded_cascode_amplifier.asc
Mp1 Vsp Vbp Vddb Vddb pch l={L} w={W} m={Mp}
Mp2 Vbp Vcp Vsp Vddb pch l={L} w={W} m={Mp}
Mp3 Vcp Vcp Vddb Vddb pch l={L} w={W} m={Mp}
Mn1 Vsn Vbn 0 0 nch l={L} w={W} m={Mn}
Mn2 Vbn Vcn Vsn 0 nch l={L} w={W} m={Mn}
Mn3 Vcn Vcn 0 0 nch l={L} w={W} m={Mn}
Ibm Vbp Vbn {Ibm}
Ibn Vddb Vcn {Ibm*Rn}
Ibp Vcp 0 {Ibm*Rp}
V1 Vddb 0 1.8
V2 Vdd 0 1.8
C1 Vdd Vbp {Cbig}
C2 Vdd Vsp {Cbig}
C3 Vdd Vcp {Cbig}
C4 0 Vbn {Cbig}
C5 0 Vsn {Cbig}
C6 0 Vcn {Cbig}
E1 N002 Vbcm N003 Vbn 1
R1 N002 Voutn {Rbig}
R2 Voutp N002 {Rbig}
C7 Voutp Vbcm {Cfb}
C8 Voutn Vbcm {Cfb}
Vcm N003 0 0.9
E2 N005 Vpl Vgpp Vgpn {Aadd/2}
E3 Vpr N005 Vgpp Vgpn {Aadd/2}
E4 N005 0 Vcp 0 1
E5 N006 Vnl Vgnp Vgnn {Aadd/2}
E6 Vnr N006 Vgnp Vgnn {Aadd/2}
E7 N006 0 Vcn 0 1
Mp1.2 Vgpn Vbp Vdd Vdd pch l={L} w={W} m={Mp13}
Mn5.2 Vgnn Vbcm 0 0 nch l={L} w={W} m={Mn56}
Mp2.2 Voutp Vpr Vgpn Vdd pch l={L} w={W} m={Mp24}
Mn6.2 Voutp Vnr Vgnn 0 nch l={L} w={W} m={Mn56}
Mp3.2 Vgpp Vbp Vdd Vdd pch l={L} w={W} m={Mp13}
Mn7.2 Vgnp Vbcm 0 0 nch l={L} w={W} m={Mn78}
Mp4.2 Voutn Vpl Vgpp Vdd pch l={L} w={W} m={Mp24}
Mn8.2 Voutn Vnl Vgnp 0 nch l={L} w={W} m={Mn78}
Mn4.2 Vgpp Vin N001 0 nch l={L} w={W} m={Mn34}
Mn3.2 Vgpn Vip N001 0 nch l={L} w={W} m={Mn34}
Mn2.2 N001 Vbcn N004 0 nch l={L} w={W} m={Mn12}
Mn1.2 N004 Vbn 0 0 nch l={L} w={W} m={Mn12}
Mp1.3 Vgpn_rep Vbp Vdd Vdd pch l={L} w={W} m={Mp13}
Mn5.3 Vgnn_rep Vbcm_rep 0 0 nch l={L} w={W} m={Mn56}
Mp2.3 Voutp2 Vpr_rep Vgpn_rep Vdd pch l={L} w={W} m={Mp24}
Mn6.3 Voutp2 Vnr_rep Vgnn_rep 0 nch l={L} w={W} m={Mn56}
Mp3.3 Vgpp_rep Vbp Vdd Vdd pch l={L} w={W} m={Mp13}
Mn7.3 Vgnp_rep Vbcm_rep 0 0 nch l={L} w={W} m={Mn78}
Mp4.3 Voutn2 Vpl_rep Vgpp_rep Vdd pch l={L} w={W} m={Mp24}
Mn8.3 Voutn2 Vnl_rep Vgnp_rep 0 nch l={L} w={W} m={Mn78}
Mn4.3 Vgpp_rep Vin_rep N011 0 nch l={L} w={W} m={Mn34}
Mn3.3 Vgpn_rep Vip_rep N011 0 nch l={L} w={W} m={Mn34}
Mn2.3 N011 Vbcn N013 0 nch l={L} w={W} m={Mn12}
Mn1.3 N013 Vbn 0 0 nch l={L} w={W} m={Mn12}
E8 N009 Vpl_rep Vgpp_rep Vgpn_rep {Aadd/2}
E9 Vpr_rep N009 Vgpp_rep Vgpn_rep {Aadd/2}
E10 N009 0 Vcp 0 1
E11 N010 Vnl_rep Vgnp_rep Vgnn_rep {Aadd/2}
E12 Vnr_rep N010 Vgnp_rep Vgnn_rep {Aadd/2}
E13 N010 0 Vcn 0 1
E14 N007 Vbcm_rep N008 Vbn 1
R3 N007 Voutn2 {Rbig}
R4 Voutp2 N007 {Rbig}
C9 Voutp2 Vbcm_rep {Cfb}
C10 Voutn2 Vbcm_rep {Cfb}
Vcm1 N008 0 0.9
E15 Vbcn 0 Vcn 0 1
C11 0 Voutn {Cload}
C12 0 Voutp {Cload}
L1 Vinpn Vin {Lbig}
L2 Vip Vinpp {Lbig}
R5 Voutp Vinpp {Rfb}
C13 Voutp Vinpp {Cfb}
R6 Vinpn Voutn {Rfb}
C14 Vinpn Voutn {Cfb}
R7 N012 Vinpn {Rin}
C15 N012 Vinpn {Cin}
R8 N012 Vinpp {Rin}
C16 N012 Vinpp {Cin}
V3 Vin N014 AC 0.5 180
V4 Vip N014 AC 0.5 180
V5 N014 0 0.9
V6 N012 0 0.9
C17 0 Voutn2 {Cload}
C18 0 Voutp2 {Cload}
R9 Vin_rep Voutn2 {Rfb}
R10 Vip_rep Voutp2 {Rfb}
.model NMOS NMOS
.model PMOS PMOS
.lib standard.mos
.param W=1u L=0.18u Mp=60 Mn=11 Ibm=200u Rn=5.8 Rp=7.5 mp_ratio={Mp/Mn}
.lib 'C:\Program Files\LTC\LTspiceXVII\lib\cmp\logic018 no1of.l' TT
* Biasing Circuit
* Biasing Voltage Source
* Voltage Source
.param Cbig=1000n Lbig=1000 Rbig=100G Rin=100G
* Decoupling Capacitors
* Ideal CMFB Unloaded
* Ideal Gain-Boosting PMOS
* Unloaded
* Ideal Gain-Boosting NMOS
* Unloaded
* Ideal
* Gain-Boosting
* PMOS
* Ideal
* CMFB
* Ideal
* Gain-Boosting
* NMOS
* OpAmp with ideal Gain-Boosting Unloaded
* Ideal
* Gain-Boosting
* PMOS
* Ideal
* CMFB
* Ideal
* Gain-Boosting
* NMOS
* OpAmp with ideal Gain-Boosting Loaded
* Ideal Gain-Boosting PMOS
* Loaded
* Ideal Gain-Boosting NMOS
* Loaded
* Ideal CMFB Loaded
* Vsp & Vsn are used for ration & ratiop determination, unused in the opamp
* Vbcn
* OpAmp in Feedback
.param Aadd=100 Cfb={Cin/8} Rfb={Rin*8} Cload={Cin}
.param Mn12={4*ScaleA} Mn56={2*ScaleA} Mn78={2*ScaleA} Mp13={4*ScaleA*mp_ratio} Mp24={2*ScaleA*mp_ratio}
.param Mn34={2*ScaleA} ScaleA=1 Cin=1.5p
.op
.backanno
.end

* Results of the author's LTspice run, read from the files saved beside the schematic
* Operating Point:
*   V(vsp) = 1.607 V
*   V(vbp) = 1.191 V
*   V(vddb) = 1.8 V
*   V(vcp) = 945 mV
*   V(vsn) = 188.7 mV
*   V(vbn) = 634.8 mV
*   V(vcn) = 861.5 mV
*   V(vdd) = 1.8 V
*   V(n002) = 904.1 mV
*   V(vbcm) = 638.8 mV
*   V(n003) = 900 mV
*   V(voutn) = 904.1 mV
*   V(voutp) = 904.1 mV
*   V(n005) = 945 mV
*   V(vpl) = 945 mV
*   V(vgpp) = 1.605 V
*   V(vgpn) = 1.605 V
*   V(vpr) = 945 mV
*   V(n006) = 861.5 mV
*   V(vnl) = 861.5 mV
*   V(vgnp) = 191.9 mV
*   V(vgnn) = 191.9 mV
*   V(vnr) = 861.5 mV
*   V(vin) = 900 mV
*   V(n001) = 240.7 mV
*   V(vip) = 900 mV
*   V(vbcn) = 861.5 mV
*   V(n004) = 155.9 mV
*   V(vgpn_rep) = 1.604 V
*   V(vgnn_rep) = 192 mV
*   V(vbcm_rep) = 638.7 mV
*   V(voutp2) = 903.9 mV
*   V(vpr_rep) = 945 mV
*   V(vnr_rep) = 861.5 mV
*   V(vgpp_rep) = 1.604 V
*   V(vgnp_rep) = 192 mV
*   V(voutn2) = 903.9 mV
*   V(vpl_rep) = 945 mV
*   V(vnl_rep) = 861.5 mV
*   V(vin_rep) = 903.9 mV
*   V(n011) = 243.7 mV
*   V(vip_rep) = 903.9 mV
*   V(n013) = 157 mV
*   V(n009) = 945 mV
*   V(n010) = 861.5 mV
*   V(n007) = 903.9 mV
*   V(n008) = 900 mV
*   V(vinpn) = 900 mV
*   V(vinpp) = 900 mV
*   V(n012) = 900 mV
*   V(n014) = 900 mV
*   Id(Mn1.3) = 69.72 µA
*   Ig(Mn1.3) = 0 A
*   Ib(Mn1.3) = -668 fA
*   Is(Mn1.3) = -69.72 µA
*   Id(Mn2.3) = 69.72 µA
*   Ig(Mn2.3) = 0 A
*   Ib(Mn2.3) = -1.683 pA
*   Is(Mn2.3) = -69.72 µA
*   Id(Mn3.3) = 34.86 µA
*   Ig(Mn3.3) = 0 A
*   Ib(Mn3.3) = -1.988 nA
*   Is(Mn3.3) = -34.86 µA
*   Id(Mn4.3) = 34.86 µA
*   Ig(Mn4.3) = 0 A
*   Ib(Mn4.3) = -1.988 nA
*   Is(Mn4.3) = -34.86 µA
*   Id(Mn8.3) = 38.04 µA
*   Ig(Mn8.3) = 0 A
*   Ib(Mn8.3) = -2.278 pA
*   Is(Mn8.3) = -38.04 µA
*   Id(Mn7.3) = 38.04 µA
*   Ig(Mn7.3) = 0 A
*   Ib(Mn7.3) = -404 fA
*   Is(Mn7.3) = -38.04 µA
*   Id(Mn6.3) = 38.04 µA
*   Ig(Mn6.3) = 0 A
*   Ib(Mn6.3) = -2.278 pA
*   Is(Mn6.3) = -38.04 µA
*   Id(Mn5.3) = 38.04 µA
*   Ig(Mn5.3) = 0 A
*   Ib(Mn5.3) = -404 fA
*   Is(Mn5.3) = -38.04 µA
*   Id(Mn1.2) = 69.6 µA
*   Ig(Mn1.2) = 0 A
*   Ib(Mn1.2) = -663.6 fA
*   Is(Mn1.2) = -69.6 µA
*   Id(Mn2.2) = 69.6 µA
*   Ig(Mn2.2) = 0 A
*   Ib(Mn2.2) = -1.666 pA
*   Is(Mn2.2) = -69.6 µA
*   Id(Mn3.2) = 34.8 µA
*   Ig(Mn3.2) = 0 A
*   Ib(Mn3.2) = -2.036 nA
*   Is(Mn3.2) = -34.8 µA
*   Id(Mn4.2) = 34.8 µA
*   Ig(Mn4.2) = 0 A
*   Ib(Mn4.2) = -2.036 nA
*   Is(Mn4.2) = -34.8 µA
*   Id(Mn8.2) = 38.09 µA
*   Ig(Mn8.2) = 0 A
*   Ib(Mn8.2) = -2.278 pA
*   Is(Mn8.2) = -38.09 µA
*   Id(Mn7.2) = 38.09 µA
*   Ig(Mn7.2) = 0 A
*   Ib(Mn7.2) = -403.8 fA
*   Is(Mn7.2) = -38.09 µA
*   Id(Mn6.2) = 38.09 µA
*   Ig(Mn6.2) = 0 A
*   Ib(Mn6.2) = -2.278 pA
*   Is(Mn6.2) = -38.09 µA
*   Id(Mn5.2) = 38.09 µA
*   Ig(Mn5.2) = 0 A
*   Ib(Mn5.2) = -403.8 fA
*   Is(Mn5.2) = -38.09 µA
*   Id(Mn3) = 1.16 mA
*   Ig(Mn3) = 0 A
*   Ib(Mn3) = -14.74 pA
*   Is(Mn3) = -1.16 mA
*   Id(Mn2) = 200 µA
*   Ig(Mn2) = 0 A
*   Ib(Mn2) = -9.278 pA
*   Is(Mn2) = -200 µA
*   Id(Mn1) = 200 µA
*   Ig(Mn1) = 0 A
*   Ib(Mn1) = -2.185 pA
*   Is(Mn1) = -200 µA
*   Id(Mp4.3) = -38.04 µA
*   Ig(Mp4.3) = 0 A
*   Ib(Mp4.3) = 12.13 pA
*   Is(Mp4.3) = 38.04 µA
*   Id(Mp3.3) = -72.9 µA
*   Ig(Mp3.3) = 0 A
*   Ib(Mp3.3) = 4.484 pA
*   Is(Mp3.3) = 72.9 µA
*   Id(Mp2.3) = -38.04 µA
*   Ig(Mp2.3) = 0 A
*   Ib(Mp2.3) = 12.13 pA
*   Is(Mp2.3) = 38.04 µA
*   Id(Mp1.3) = -72.9 µA
*   Ig(Mp1.3) = 0 A
*   Ib(Mp1.3) = 4.484 pA
*   Is(Mp1.3) = 72.9 µA
*   Id(Mp4.2) = -38.09 µA
*   Ig(Mp4.2) = 0 A
*   Ib(Mp4.2) = 12.12 pA
*   Is(Mp4.2) = 38.09 µA
*   Id(Mp3.2) = -72.9 µA
*   Ig(Mp3.2) = 0 A
*   Ib(Mp3.2) = 4.482 pA
*   Is(Mp3.2) = 72.9 µA
*   Id(Mp2.2) = -38.09 µA
*   Ig(Mp2.2) = 0 A
*   Ib(Mp2.2) = 12.12 pA
*   Is(Mp2.2) = 38.09 µA
*   Id(Mp1.2) = -72.9 µA
*   Ig(Mp1.2) = 0 A
*   Ib(Mp1.2) = 4.482 pA
*   Is(Mp1.2) = 72.9 µA
*   Id(Mp3) = -1.5 mA
*   Ig(Mp3) = 0 A
*   Ib(Mp3) = 51.9 pA
*   Is(Mp3) = 1.5 mA
*   Id(Mp2) = -200 µA
*   Ig(Mp2) = 0 A
*   Ib(Mp2) = 49.32 pA
*   Is(Mp2) = 200 µA
*   Id(Mp1) = -200 µA
*   Ig(Mp1) = 0 A
*   Ib(Mp1) = 12.17 pA
*   Is(Mp1) = 200 µA
*   I(C18) = 0 A
*   I(C17) = 0 A
*   I(C16) = 0 A
*   I(C15) = 0 A
*   I(C14) = 0 A
*   I(C13) = 0 A
*   I(C12) = 0 A
*   I(C11) = 0 A
*   I(C10) = 0 A
*   I(C9) = 0 A
*   I(C8) = 0 A
*   I(C7) = 0 A
*   I(C6) = 0 A
*   I(C5) = 0 A
*   I(C4) = 0 A
*   I(C3) = 0 A
*   I(C2) = 0 A
*   I(C1) = 0 A
*   I(L2) = 0 A
*   I(L1) = 0 A
*   I(Ibp) = 1.5 mA
*   I(Ibn) = 1.16 mA
*   I(Ibm) = 200 µA
*   I(R10) = 0 A
*   I(R9) = 0 A
*   I(R8) = 0 A
*   I(R7) = 0 A
*   I(R6) = -5.106 fA
*   I(R5) = 5.106 fA
*   I(R4) = 0 A
*   I(R3) = 0 A
*   I(R2) = 0 A
*   I(R1) = 0 A
*   I(E15) = 0 A
*   I(E14) = 0 A
*   I(E13) = 0 A
*   I(E12) = 0 A
*   I(E11) = 0 A
*   I(E10) = 0 A
*   I(E9) = 0 A
*   I(E8) = 0 A
*   I(E7) = 0 A
*   I(E6) = 0 A
*   I(E5) = 0 A
*   I(E4) = 0 A
*   I(E3) = 0 A
*   I(E2) = 0 A
*   I(E1) = 0 A
*   I(V6) = 0 A
*   I(V5) = 0 A
*   I(V4) = 0 A
*   I(V3) = 0 A
*   I(Vcm1) = 0 A
*   I(Vcm) = 0 A
*   I(V2) = -291.6 µA
*   I(V1) = -2.86 mA
* From the log:
*   Semiconductor Device Operating Points:
*                           --- BSIM3 MOSFETS ---
*   Name:       mn1.3       mn2.3       mn3.3       mn4.3       mn8.3
*   Model:      nch.9       nch.9       nch.9       nch.9       nch.9
*   Id:        6.97e-05    6.97e-05    3.49e-05    3.49e-05    3.80e-05
*   Vgs:       6.35e-01    7.04e-01    6.60e-01    6.60e-01    6.69e-01
*   Vds:       1.57e-01    8.67e-02    1.36e+00    1.36e+00    7.12e-01
*   Vbs:       0.00e+00   -1.57e-01   -2.44e-01   -2.44e-01   -1.92e-01
*   Vth:       5.26e-01    5.72e-01    5.89e-01    5.89e-01    5.78e-01
*   Vdsat:     1.18e-01    1.31e-01    1.02e-01    1.02e-01    1.11e-01
*   Gm:        7.27e-04    5.59e-04    4.23e-04    4.23e-04    4.37e-04
*   Gds:       1.10e-04    4.50e-04    8.82e-06    8.82e-06    1.16e-05
*   Gmb        2.17e-04    1.52e-04    1.04e-04    1.04e-04    1.13e-04
*   Cbd:       0.00e+00    0.00e+00    0.00e+00    0.00e+00    0.00e+00
*   Cbs:       0.00e+00    0.00e+00    0.00e+00    0.00e+00    0.00e+00
*   Cgsov:     1.33e-15    1.33e-15    6.66e-16    6.66e-16    6.66e-16
*   Cgdov:     1.33e-15    1.33e-15    6.66e-16    6.66e-16    6.66e-16
*   Cgbov:     1.27e-16    1.27e-16    6.37e-17    6.37e-17    6.37e-17
*   dQgdVgb:   7.14e-15    7.43e-15    3.40e-15    3.40e-15    3.49e-15
*   dQgdVdb:  -1.38e-15   -1.71e-15   -6.60e-16   -6.60e-16   -6.61e-16
*   dQgdVsb:  -4.98e-15   -5.04e-15   -2.30e-15   -2.30e-15   -2.41e-15
*   dQddVgb:  -1.49e-15   -2.07e-15   -6.67e-16   -6.67e-16   -6.69e-16
*   dQddVdb:   1.48e-15    2.42e-15    6.66e-16    6.66e-16    6.67e-16
*   dQddVsb:   5.67e-17   -1.42e-16    6.12e-19    6.12e-19    2.32e-18
*   dQbdVgb:  -9.77e-16   -7.67e-16   -5.11e-16   -5.11e-16   -5.04e-16
*   dQbdVdb:  -4.40e-17   -3.37e-16    1.14e-18    1.14e-18    9.47e-19
*   dQbdVsb:  -8.23e-16   -6.69e-16   -3.14e-16   -3.14e-16   -3.39e-16
*   Name:       mn7.3       mn6.3       mn5.3       mn1.2       mn2.2
*   Model:      nch.9       nch.9       nch.9       nch.9       nch.9
*   Id:        3.80e-05    3.80e-05    3.80e-05    6.96e-05    6.96e-05
*   Vgs:       6.39e-01    6.69e-01    6.39e-01    6.35e-01    7.06e-01
*   Vds:       1.92e-01    7.12e-01    1.92e-01    1.56e-01    8.48e-02
*   Vbs:       0.00e+00   -1.92e-01    0.00e+00    0.00e+00   -1.56e-01
*   Vth:       5.26e-01    5.78e-01    5.26e-01    5.26e-01    5.71e-01
*   Vdsat:     1.19e-01    1.11e-01    1.19e-01    1.18e-01    1.32e-01
*   Gm:        3.95e-04    4.37e-04    3.95e-04    7.25e-04    5.50e-04
*   Gds:       4.24e-05    1.16e-05    4.24e-05    1.11e-04    4.70e-04
*   Gmb        1.18e-04    1.13e-04    1.18e-04    2.17e-04    1.50e-04
*   Cbd:       0.00e+00    0.00e+00    0.00e+00    0.00e+00    0.00e+00
*   Cbs:       0.00e+00    0.00e+00    0.00e+00    0.00e+00    0.00e+00
*   Cgsov:     6.66e-16    6.66e-16    6.66e-16    1.33e-15    1.33e-15
*   Cgdov:     6.66e-16    6.66e-16    6.66e-16    1.33e-15    1.33e-15
*   Cgbov:     6.37e-17    6.37e-17    6.37e-17    1.27e-16    1.27e-16
*   dQgdVgb:   3.57e-15    3.49e-15    3.57e-15    7.14e-15    7.45e-15
*   dQgdVdb:  -6.77e-16   -6.61e-16   -6.77e-16   -1.38e-15   -1.73e-15
*   dQgdVsb:  -2.50e-15   -2.41e-15   -2.50e-15   -4.98e-15   -5.04e-15
*   dQddVgb:  -7.16e-16   -6.69e-16   -7.16e-16   -1.49e-15   -2.11e-15
*   dQddVdb:   7.08e-16    6.67e-16    7.08e-16    1.48e-15    2.50e-15
*   dQddVsb:   2.34e-17    2.32e-18    2.34e-17    5.69e-17   -1.68e-16
*   dQbdVgb:  -4.96e-16   -5.04e-16   -4.96e-16   -9.76e-16   -7.54e-16
*   dQbdVdb:  -1.24e-17    9.47e-19   -1.24e-17   -4.50e-17   -3.62e-16
*   dQbdVsb:  -4.11e-16   -3.39e-16   -4.11e-16   -8.23e-16   -6.62e-16
*   Name:       mn3.2       mn4.2       mn8.2       mn7.2       mn6.2
*   Model:      nch.9       nch.9       nch.9       nch.9       nch.9
*   Id:        3.48e-05    3.48e-05    3.81e-05    3.81e-05    3.81e-05
*   Vgs:       6.59e-01    6.59e-01    6.70e-01    6.39e-01    6.70e-01
*   Vds:       1.36e+00    1.36e+00    7.12e-01    1.92e-01    7.12e-01
*   Vbs:      -2.41e-01   -2.41e-01   -1.92e-01    0.00e+00   -1.92e-01
*   Vth:       5.88e-01    5.88e-01    5.78e-01    5.26e-01    5.78e-01
*   Vdsat:     1.02e-01    1.02e-01    1.11e-01    1.20e-01    1.11e-01
*   Gm:        4.23e-04    4.23e-04    4.38e-04    3.95e-04    4.38e-04
*   Gds:       8.79e-06    8.79e-06    1.16e-05    4.25e-05    1.16e-05
*   Gmb        1.04e-04    1.04e-04    1.13e-04    1.18e-04    1.13e-04
*   Cbd:       0.00e+00    0.00e+00    0.00e+00    0.00e+00    0.00e+00
*   Cbs:       0.00e+00    0.00e+00    0.00e+00    0.00e+00    0.00e+00
*   Cgsov:     6.66e-16    6.66e-16    6.66e-16    6.66e-16    6.66e-16
*   Cgdov:     6.66e-16    6.66e-16    6.66e-16    6.66e-16    6.66e-16
*   Cgbov:     6.37e-17    6.37e-17    6.37e-17    6.37e-17    6.37e-17
*   dQgdVgb:   3.40e-15    3.40e-15    3.49e-15    3.57e-15    3.49e-15
*   dQgdVdb:  -6.61e-16   -6.61e-16   -6.61e-16   -6.77e-16   -6.61e-16
*   dQgdVsb:  -2.30e-15   -2.30e-15   -2.41e-15   -2.50e-15   -2.41e-15
*   dQddVgb:  -6.67e-16   -6.67e-16   -6.69e-16   -7.16e-16   -6.69e-16
*   dQddVdb:   6.66e-16    6.66e-16    6.67e-16    7.08e-16    6.67e-16
*   dQddVsb:   6.09e-19    6.09e-19    2.32e-18    2.34e-17    2.32e-18
*   dQbdVgb:  -5.11e-16   -5.11e-16   -5.04e-16   -4.96e-16   -5.04e-16
*   dQbdVdb:   1.14e-18    1.14e-18    9.47e-19   -1.24e-17    9.47e-19
*   dQbdVsb:  -3.15e-16   -3.15e-16   -3.40e-16   -4.11e-16   -3.40e-16
*   Name:       mn5.2        mn3         mn2         mn1        mp4.3
*   Model:      nch.9       nch.9       nch.9       nch.9       pch.9
*   Id:        3.81e-05    1.16e-03    2.00e-04    2.00e-04   -3.80e-05
*   Vgs:       6.39e-01    8.62e-01    6.73e-01    6.35e-01   -6.59e-01
*   Vds:       1.92e-01    8.62e-01    4.46e-01    1.89e-01   -7.01e-01
*   Vbs:       0.00e+00    0.00e+00   -1.89e-01    0.00e+00    1.96e-01
*   Vth:       5.26e-01    5.25e-01    5.79e-01    5.26e-01   -5.56e-01
*   Vdsat:     1.20e-01    2.21e-01    1.12e-01    1.18e-01   -1.28e-01
*   Gm:        3.95e-04    4.68e-03    2.30e-03    2.12e-03    4.65e-04
*   Gds:       4.25e-05    1.80e-04    8.37e-05    2.27e-04    9.91e-06
*   Gmb        1.18e-04    1.36e-03    6.00e-04    6.31e-04    1.44e-04
*   Cbd:       0.00e+00    0.00e+00    0.00e+00    0.00e+00    0.00e+00
*   Cbs:       0.00e+00    0.00e+00    0.00e+00    0.00e+00    0.00e+00
*   Cgsov:     6.66e-16    3.67e-15    3.67e-15    3.67e-15    3.94e-15
*   Cgdov:     6.66e-16    3.67e-15    3.67e-15    3.67e-15    3.94e-15
*   Cgbov:     6.37e-17    3.50e-16    3.50e-16    3.50e-16    5.08e-16
*   dQgdVgb:   3.57e-15    2.04e-14    1.92e-14    1.96e-14    1.96e-14
*   dQgdVdb:  -6.77e-16   -3.65e-15   -3.64e-15   -3.73e-15   -3.91e-15
*   dQgdVsb:  -2.50e-15   -1.49e-14   -1.34e-14   -1.37e-14   -1.43e-14
*   dQddVgb:  -7.16e-16   -3.68e-15   -3.70e-15   -3.94e-15   -3.95e-15
*   dQddVdb:   7.08e-16    3.68e-15    3.68e-15    3.89e-15    3.95e-15
*   dQddVsb:   2.34e-17    1.15e-17    3.11e-17    1.32e-16    1.32e-17
*   dQbdVgb:  -4.96e-16   -2.84e-15   -2.76e-15   -2.73e-15   -2.92e-15
*   dQbdVdb:  -1.24e-17    1.06e-18    2.03e-18   -6.77e-17    3.28e-18
*   dQbdVsb:  -4.11e-16   -2.09e-15   -1.89e-15   -2.26e-15   -1.21e-15
*   Name:       mp3.3       mp2.3       mp1.3       mp4.2       mp3.2
*   Model:      pch.9       pch.9       pch.9       pch.9       pch.9
*   Id:       -7.29e-05   -3.80e-05   -7.29e-05   -3.81e-05   -7.29e-05
*   Vgs:      -6.09e-01   -6.59e-01   -6.09e-01   -6.60e-01   -6.09e-01
*   Vds:      -1.96e-01   -7.01e-01   -1.96e-01   -7.00e-01   -1.95e-01
*   Vbs:       0.00e+00    1.96e-01    0.00e+00    1.95e-01    0.00e+00
*   Vth:      -4.95e-01   -5.56e-01   -4.95e-01   -5.56e-01   -4.95e-01
*   Vdsat:    -1.32e-01   -1.28e-01   -1.32e-01   -1.28e-01   -1.32e-01
*   Gm:        8.28e-04    4.65e-04    8.28e-04    4.65e-04    8.28e-04
*   Gds:       6.50e-05    9.91e-06    6.50e-05    9.92e-06    6.50e-05
*   Gmb        2.84e-04    1.44e-04    2.84e-04    1.45e-04    2.84e-04
*   Cbd:       0.00e+00    0.00e+00    0.00e+00    0.00e+00    0.00e+00
*   Cbs:       0.00e+00    0.00e+00    0.00e+00    0.00e+00    0.00e+00
*   Cgsov:     7.88e-15    3.94e-15    7.88e-15    3.94e-15    7.88e-15
*   Cgdov:     7.88e-15    3.94e-15    7.88e-15    3.94e-15    7.88e-15
*   Cgbov:     1.02e-15    5.08e-16    1.02e-15    5.08e-16    1.02e-15
*   dQgdVgb:   3.98e-14    1.96e-14    3.98e-14    1.96e-14    3.98e-14
*   dQgdVdb:  -7.95e-15   -3.91e-15   -7.95e-15   -3.91e-15   -7.95e-15
*   dQgdVsb:  -2.90e-14   -1.43e-14   -2.90e-14   -1.43e-14   -2.90e-14
*   dQddVgb:  -8.34e-15   -3.95e-15   -8.34e-15   -3.95e-15   -8.34e-15
*   dQddVdb:   8.27e-15    3.95e-15    8.27e-15    3.95e-15    8.27e-15
*   dQddVsb:   2.38e-16    1.32e-17    2.38e-16    1.33e-17    2.38e-16
*   dQbdVgb:  -5.84e-15   -2.92e-15   -5.84e-15   -2.92e-15   -5.84e-15
*   dQbdVdb:  -1.25e-16    3.28e-18   -1.25e-16    3.28e-18   -1.25e-16
*   dQbdVsb:  -3.08e-15   -1.21e-15   -3.08e-15   -1.21e-15   -3.08e-15
*   Name:       mp2.2       mp1.2        mp3         mp2         mp1
*   Model:      pch.9       pch.9       pch.9       pch.9       pch.9
*   Id:       -3.81e-05   -7.29e-05   -1.50e-03   -2.00e-04   -2.00e-04
*   Vgs:      -6.60e-01   -6.09e-01   -8.55e-01   -6.62e-01   -6.09e-01
*   Vds:      -7.00e-01   -1.95e-01   -8.55e-01   -4.16e-01   -1.93e-01
*   Vbs:       1.95e-01    0.00e+00    0.00e+00    1.93e-01    0.00e+00
*   Vth:      -5.56e-01   -4.95e-01   -4.92e-01   -5.57e-01   -4.95e-01
*   Vdsat:    -1.28e-01   -1.32e-01   -2.89e-01   -1.29e-01   -1.32e-01
*   Gm:        4.65e-04    8.28e-04    6.85e-03    2.42e-03    2.27e-03
*   Gds:       9.92e-06    6.50e-05    2.66e-04    7.54e-05    1.83e-04
*   Gmb        1.45e-04    2.84e-04    2.33e-03    7.58e-04    7.79e-04
*   Cbd:       0.00e+00    0.00e+00    0.00e+00    0.00e+00    0.00e+00
*   Cbs:       0.00e+00    0.00e+00    0.00e+00    0.00e+00    0.00e+00
*   Cgsov:     3.94e-15    7.88e-15    2.17e-14    2.17e-14    2.17e-14
*   Cgdov:     3.94e-15    7.88e-15    2.17e-14    2.17e-14    2.17e-14
*   Cgbov:     5.08e-16    1.02e-15    2.79e-15    2.79e-15    2.79e-15
*   dQgdVgb:   1.96e-14    3.98e-14    1.14e-13    1.08e-13    1.09e-13
*   dQgdVdb:  -3.91e-15   -7.95e-15   -2.15e-14   -2.15e-14   -2.19e-14
*   dQgdVsb:  -1.43e-14   -2.90e-14   -8.67e-14   -7.89e-14   -7.97e-14
*   dQddVgb:  -3.95e-15   -8.34e-15   -2.18e-14   -2.19e-14   -2.30e-14
*   dQddVdb:   3.95e-15    8.27e-15    2.17e-14    2.18e-14    2.28e-14
*   dQddVsb:   1.33e-17    2.38e-16    6.15e-17    1.93e-16    6.66e-16
*   dQbdVgb:  -2.92e-15   -5.84e-15   -1.70e-14   -1.60e-14   -1.60e-14
*   dQbdVdb:   3.28e-18   -1.25e-16    2.22e-18   -7.34e-18   -3.59e-16
*   dQbdVsb:  -1.21e-15   -3.08e-15   -7.09e-15   -6.74e-15   -8.48e-15